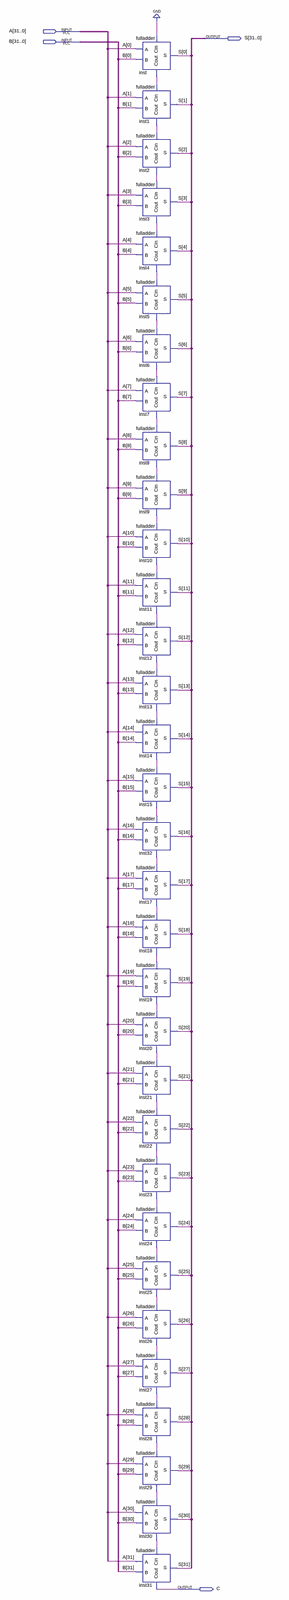
[diagram p0: schematic sheet, whole]
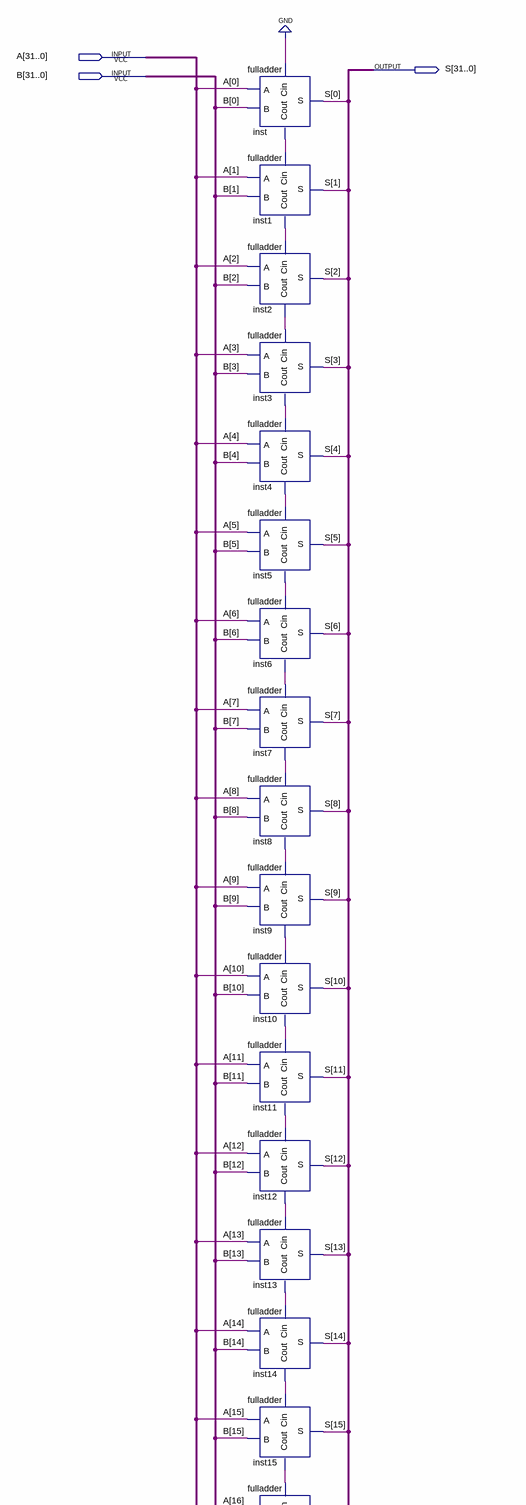
[diagram p1: schematic sheet, upper part]
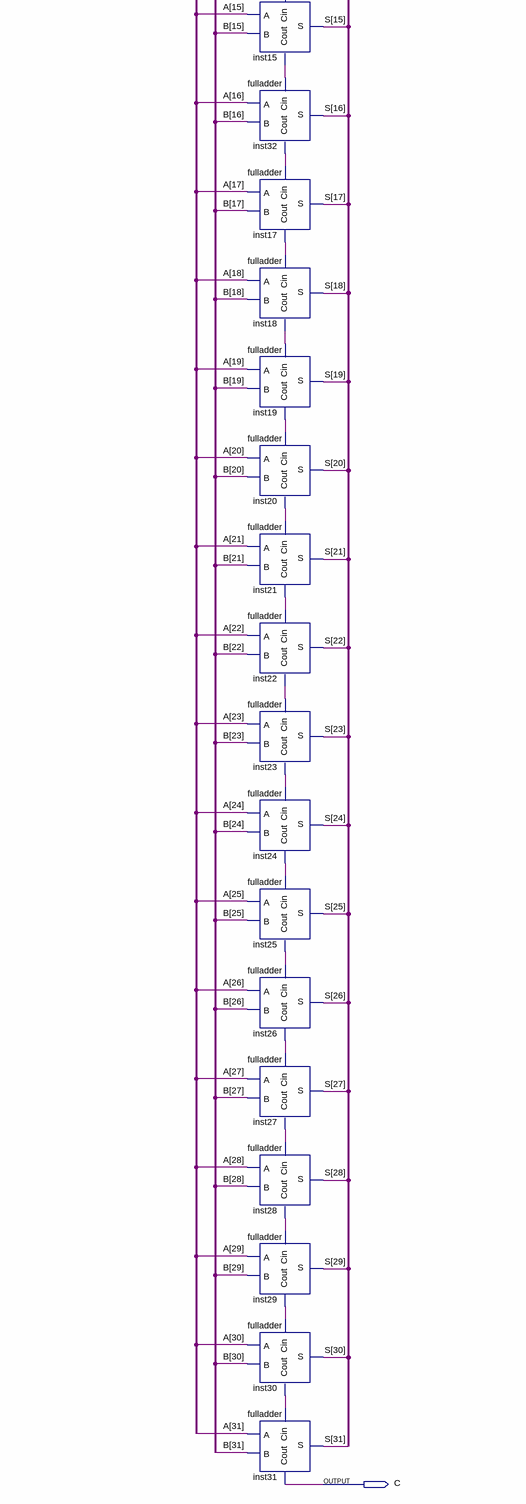
[diagram p2: schematic sheet, lower part]
// Quartus schematic fulladder32bit.bdf as structural Verilog: 32 symbols, 4 pins
module fulladder32bit (
  input  [31:0] A,
  input  [31:0] B,
  output [31:0] S,
  output C
);

  wire inst1_cout, inst2_cout, inst3_cout, inst4_cout, inst5_cout, inst6_cout, inst7_cout, inst8_cout,
       inst9_cout, inst10_cout, inst11_cout, inst12_cout, inst13_cout, inst14_cout, inst15_cout, inst17_cout,
       inst18_cout, inst19_cout, inst20_cout, inst21_cout, inst22_cout, inst23_cout, inst24_cout,
       inst25_cout, inst26_cout, inst27_cout, inst28_cout, inst29_cout, inst30_cout, inst32_cout, inst_cout;

  fulladder inst (.Cin(1'b0), .A(A[0]), .B(B[0]), .Cout(inst_cout), .S(S[0]));
  fulladder inst1 (.Cin(inst_cout), .A(A[1]), .B(B[1]), .Cout(inst1_cout), .S(S[1]));
  fulladder inst2 (.Cin(inst1_cout), .A(A[2]), .B(B[2]), .Cout(inst2_cout), .S(S[2]));
  fulladder inst3 (.Cin(inst2_cout), .A(A[3]), .B(B[3]), .Cout(inst3_cout), .S(S[3]));
  fulladder inst4 (.Cin(inst3_cout), .A(A[4]), .B(B[4]), .Cout(inst4_cout), .S(S[4]));
  fulladder inst5 (.Cin(inst4_cout), .A(A[5]), .B(B[5]), .Cout(inst5_cout), .S(S[5]));
  fulladder inst6 (.Cin(inst5_cout), .A(A[6]), .B(B[6]), .Cout(inst6_cout), .S(S[6]));
  fulladder inst7 (.Cin(inst6_cout), .A(A[7]), .B(B[7]), .Cout(inst7_cout), .S(S[7]));
  fulladder inst8 (.Cin(inst7_cout), .A(A[8]), .B(B[8]), .Cout(inst8_cout), .S(S[8]));
  fulladder inst9 (.Cin(inst8_cout), .A(A[9]), .B(B[9]), .Cout(inst9_cout), .S(S[9]));
  fulladder inst10 (.Cin(inst9_cout), .A(A[10]), .B(B[10]), .Cout(inst10_cout), .S(S[10]));
  fulladder inst11 (.Cin(inst10_cout), .A(A[11]), .B(B[11]), .Cout(inst11_cout), .S(S[11]));
  fulladder inst12 (.Cin(inst11_cout), .A(A[12]), .B(B[12]), .Cout(inst12_cout), .S(S[12]));
  fulladder inst13 (.Cin(inst12_cout), .A(A[13]), .B(B[13]), .Cout(inst13_cout), .S(S[13]));
  fulladder inst14 (.Cin(inst13_cout), .A(A[14]), .B(B[14]), .Cout(inst14_cout), .S(S[14]));
  fulladder inst15 (.Cin(inst14_cout), .A(A[15]), .B(B[15]), .Cout(inst15_cout), .S(S[15]));
  fulladder inst32 (.Cin(inst15_cout), .A(A[16]), .B(B[16]), .Cout(inst32_cout), .S(S[16]));
  fulladder inst17 (.Cin(inst32_cout), .A(A[17]), .B(B[17]), .Cout(inst17_cout), .S(S[17]));
  fulladder inst18 (.Cin(inst17_cout), .A(A[18]), .B(B[18]), .Cout(inst18_cout), .S(S[18]));
  fulladder inst19 (.Cin(inst18_cout), .A(A[19]), .B(B[19]), .Cout(inst19_cout), .S(S[19]));
  fulladder inst20 (.Cin(inst19_cout), .A(A[20]), .B(B[20]), .Cout(inst20_cout), .S(S[20]));
  fulladder inst21 (.Cin(inst20_cout), .A(A[21]), .B(B[21]), .Cout(inst21_cout), .S(S[21]));
  fulladder inst22 (.Cin(inst21_cout), .A(A[22]), .B(B[22]), .Cout(inst22_cout), .S(S[22]));
  fulladder inst23 (.Cin(inst22_cout), .A(A[23]), .B(B[23]), .Cout(inst23_cout), .S(S[23]));
  fulladder inst24 (.Cin(inst23_cout), .A(A[24]), .B(B[24]), .Cout(inst24_cout), .S(S[24]));
  fulladder inst25 (.Cin(inst24_cout), .A(A[25]), .B(B[25]), .Cout(inst25_cout), .S(S[25]));
  fulladder inst26 (.Cin(inst25_cout), .A(A[26]), .B(B[26]), .Cout(inst26_cout), .S(S[26]));
  fulladder inst27 (.Cin(inst26_cout), .A(A[27]), .B(B[27]), .Cout(inst27_cout), .S(S[27]));
  fulladder inst28 (.Cin(inst27_cout), .A(A[28]), .B(B[28]), .Cout(inst28_cout), .S(S[28]));
  fulladder inst29 (.Cin(inst28_cout), .A(A[29]), .B(B[29]), .Cout(inst29_cout), .S(S[29]));
  fulladder inst30 (.Cin(inst29_cout), .A(A[30]), .B(B[30]), .Cout(inst30_cout), .S(S[30]));
  fulladder inst31 (.Cin(inst30_cout), .A(A[31]), .B(B[31]), .Cout(C), .S(S[31]));
endmodule
